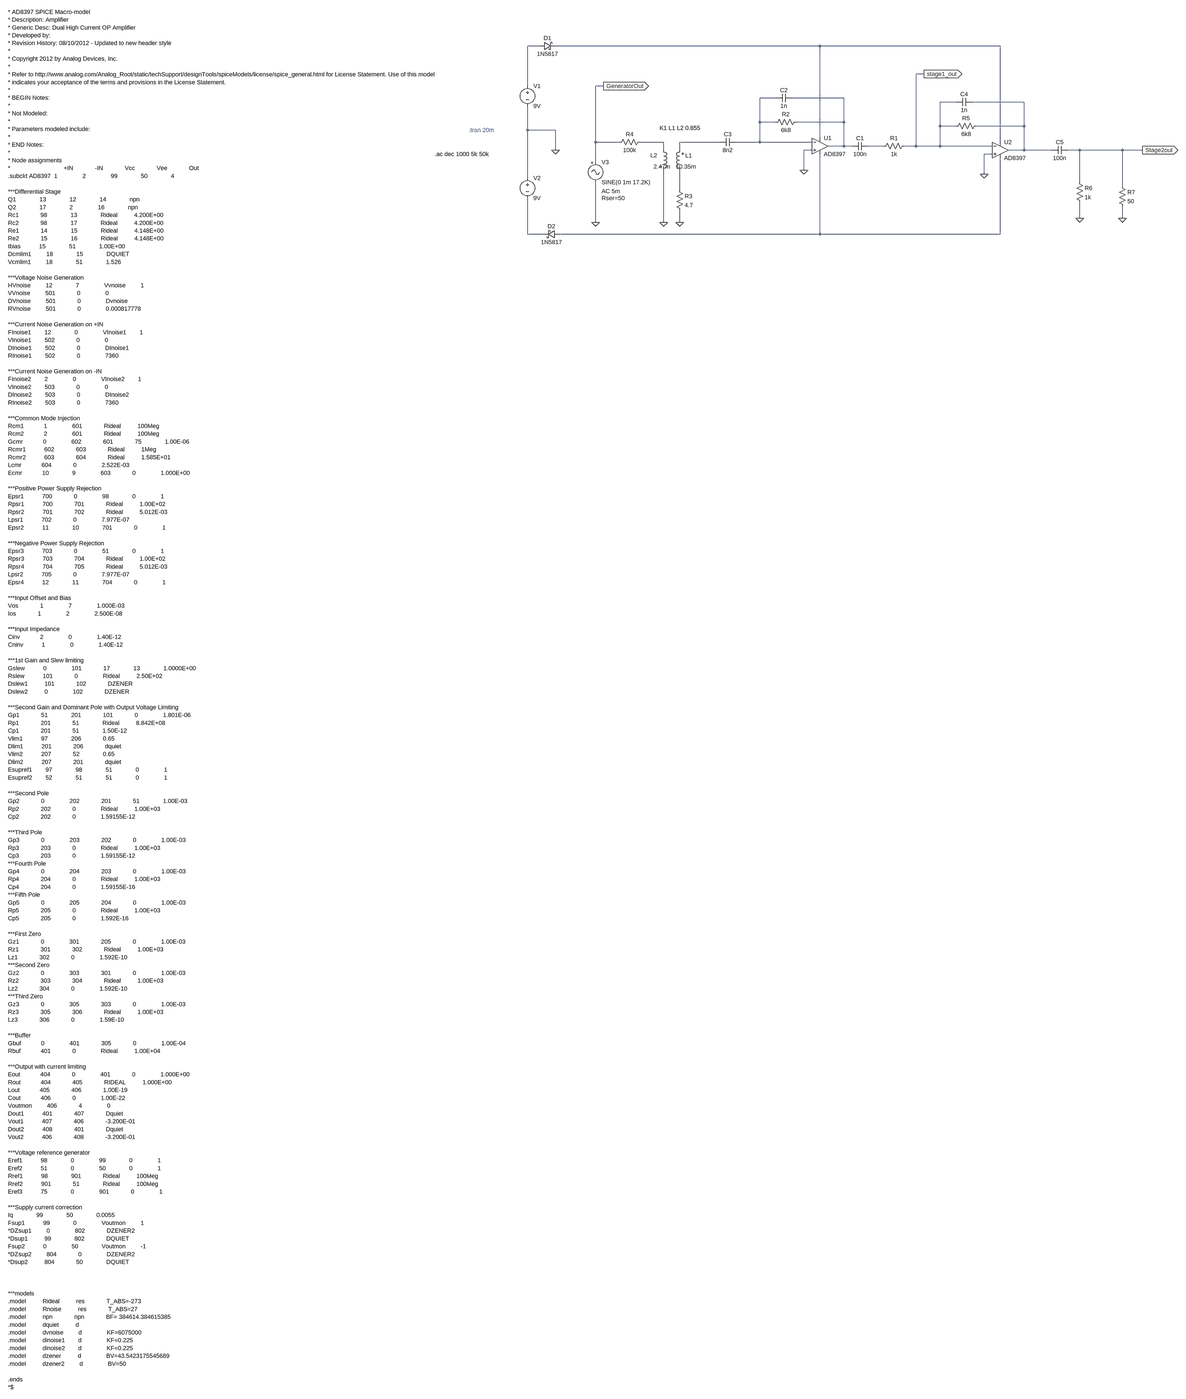
[diagram p0: schematic SAQ_Receiver_amplification_50ohm load.asc, whole sheet]
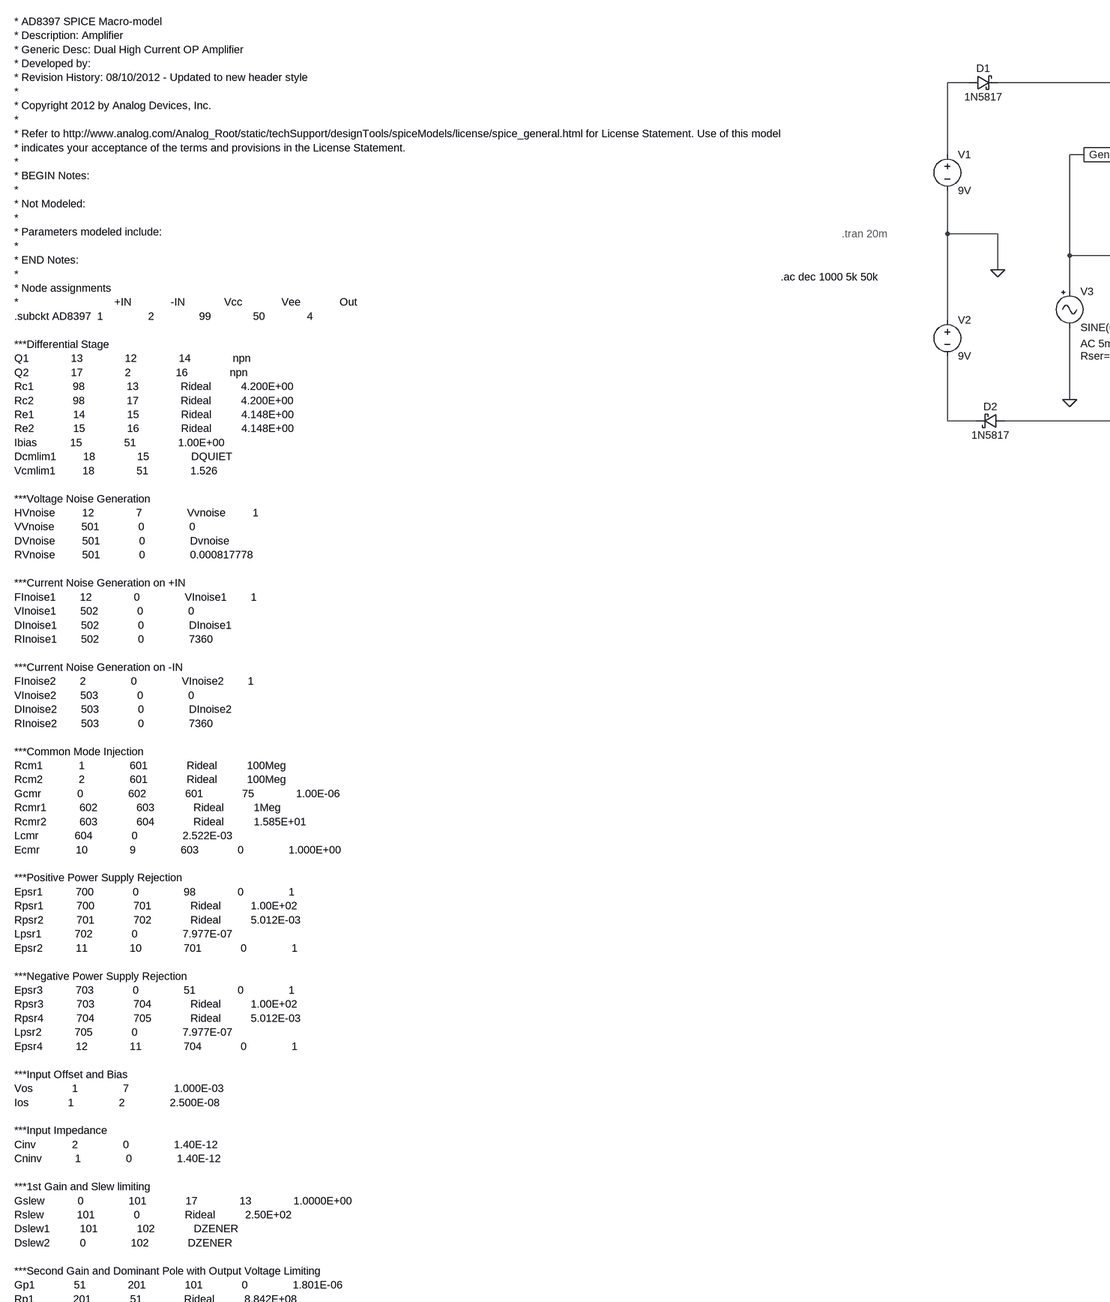
[diagram p1: schematic SAQ_Receiver_amplification_50ohm load.asc, part, row 1 of 2, column 1 of 2]
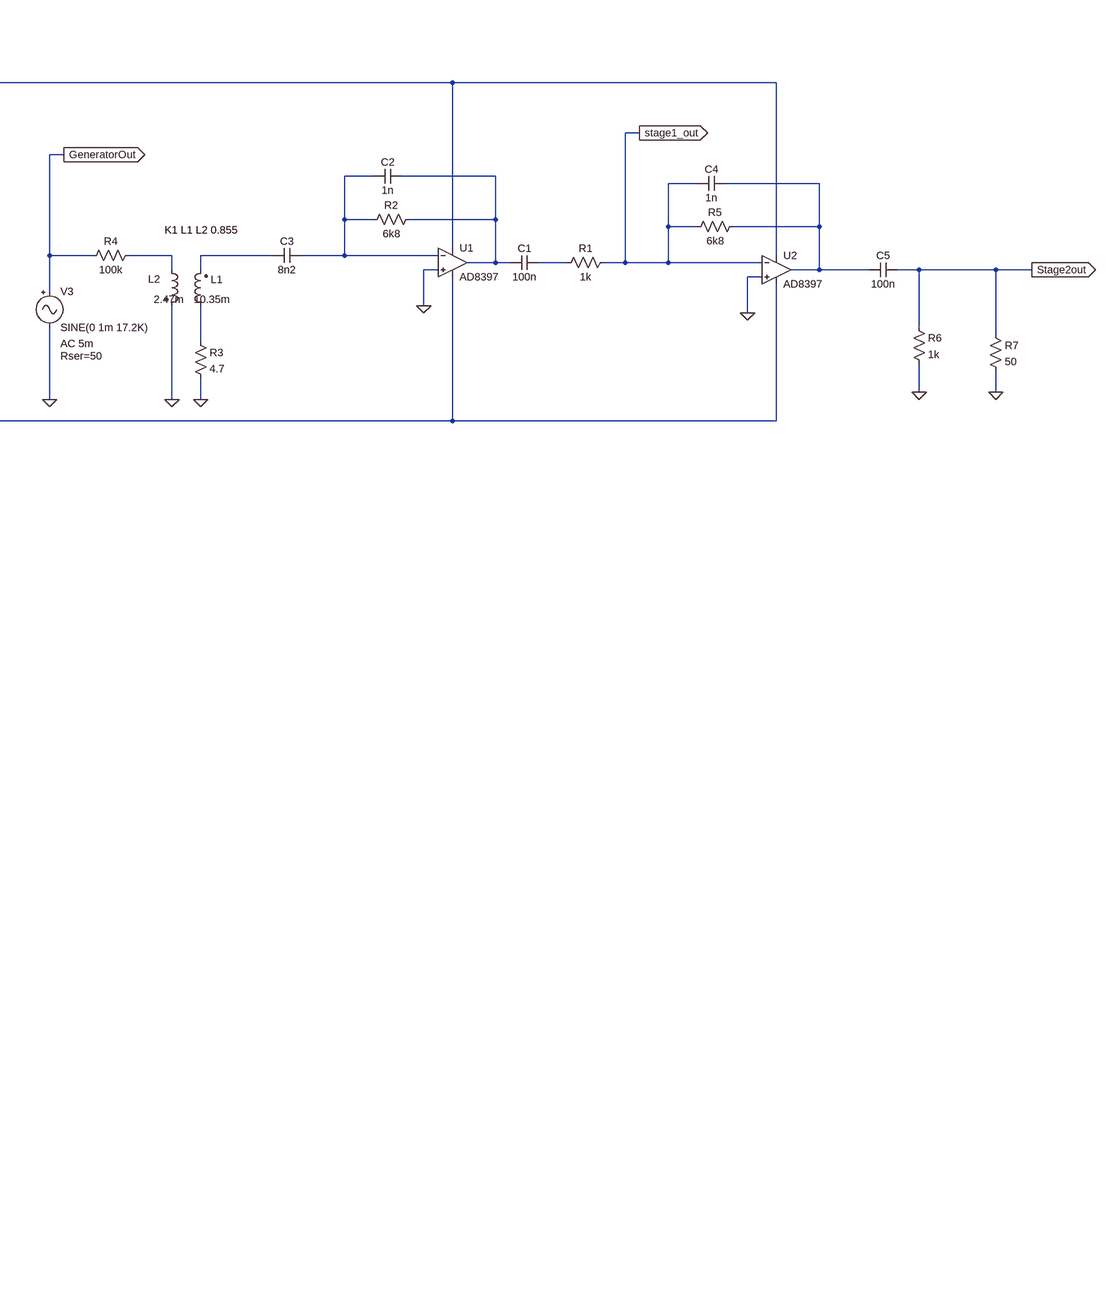
[diagram p2: schematic SAQ_Receiver_amplification_50ohm load.asc, part, row 1 of 2, column 2 of 2]
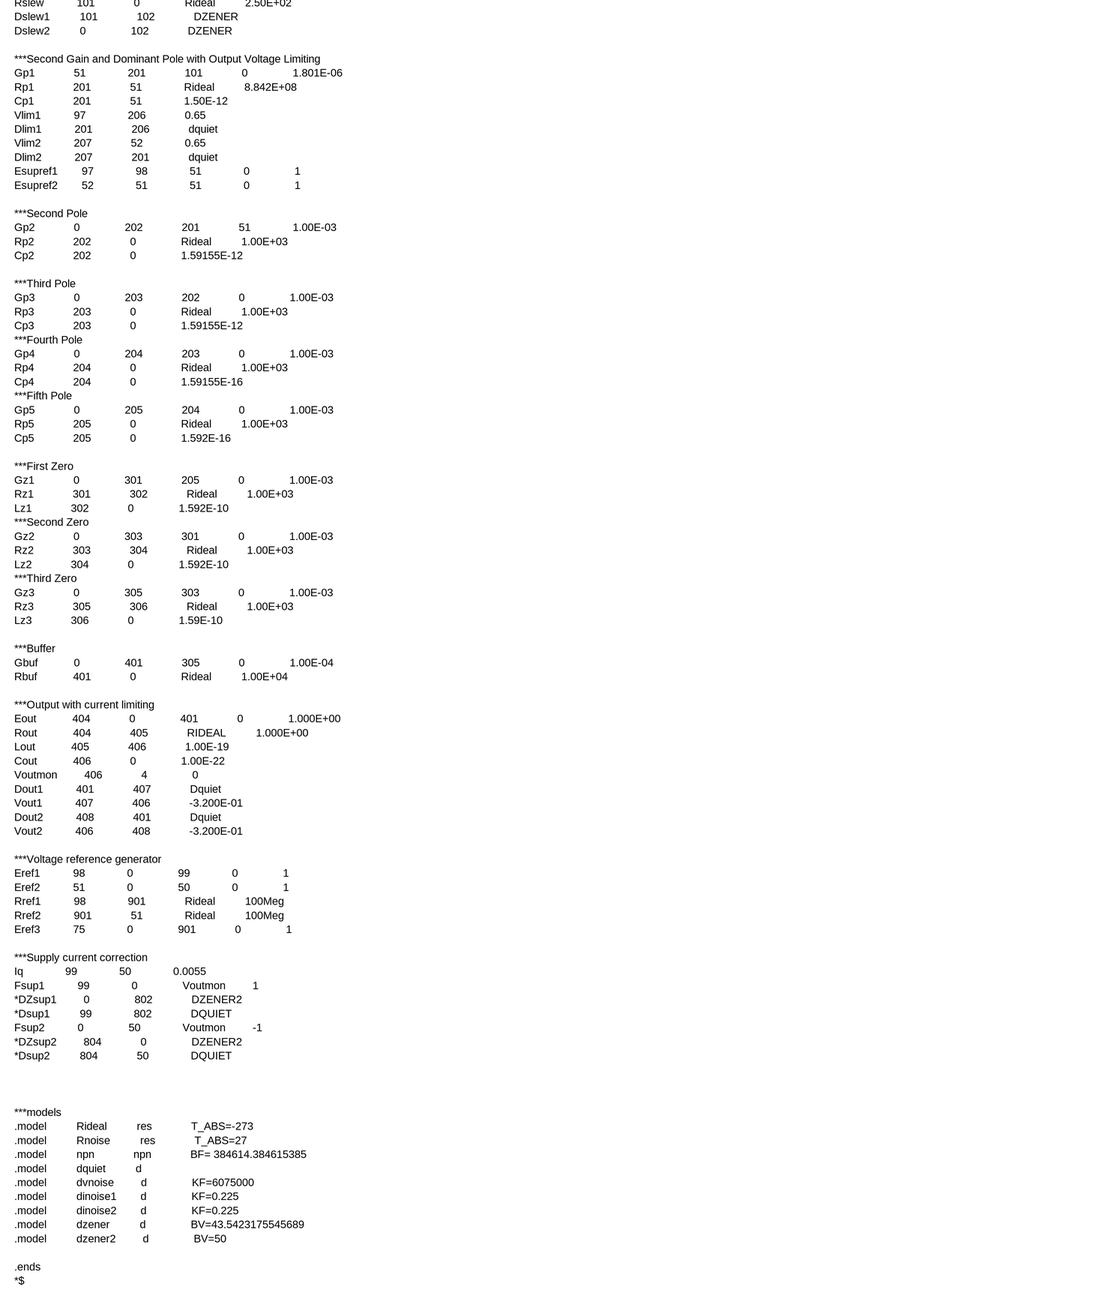
[diagram p3: schematic SAQ_Receiver_amplification_50ohm load.asc, part, row 2 of 2, column 1 of 2]
SAQ_Receiver_amplification_50ohm load.asc, the LTspice schematic file:
Version 4
SHEET 1 15028 7332
WIRE 12160 2272 12112 2272
WIRE 13440 2272 12224 2272
WIRE 14160 2272 13440 2272
WIRE 13856 2384 13824 2384
WIRE 12112 2432 12112 2272
WIRE 12576 2432 12544 2432
WIRE 13264 2480 13200 2480
WIRE 13536 2480 13328 2480
WIRE 13984 2496 13920 2496
WIRE 14256 2496 14048 2496
WIRE 13200 2576 13200 2480
WIRE 13264 2576 13200 2576
WIRE 13536 2576 13536 2480
WIRE 13536 2576 13344 2576
WIRE 13920 2592 13920 2496
WIRE 13984 2592 13920 2592
WIRE 14256 2592 14256 2496
WIRE 14256 2592 14064 2592
WIRE 12112 2608 12112 2512
WIRE 12224 2608 12112 2608
WIRE 13440 2640 13440 2272
WIRE 12544 2656 12544 2432
WIRE 12640 2656 12544 2656
WIRE 12816 2656 12720 2656
WIRE 13040 2656 12880 2656
WIRE 13200 2656 13200 2576
WIRE 13200 2656 13104 2656
WIRE 13408 2656 13200 2656
WIRE 14160 2656 14160 2272
WIRE 13536 2672 13536 2576
WIRE 13536 2672 13472 2672
WIRE 13568 2672 13536 2672
WIRE 13696 2672 13632 2672
WIRE 13824 2672 13824 2384
WIRE 13824 2672 13776 2672
WIRE 13920 2672 13920 2592
WIRE 13920 2672 13824 2672
WIRE 14128 2672 13920 2672
WIRE 12224 2688 12224 2608
WIRE 12816 2688 12816 2656
WIRE 12880 2688 12880 2656
WIRE 13408 2688 13376 2688
WIRE 14256 2688 14256 2592
WIRE 14256 2688 14192 2688
WIRE 14464 2688 14256 2688
WIRE 14576 2688 14528 2688
WIRE 14768 2688 14576 2688
WIRE 14848 2688 14768 2688
WIRE 14128 2704 14096 2704
WIRE 12544 2736 12544 2656
WIRE 13376 2768 13376 2688
WIRE 14096 2784 14096 2704
WIRE 12112 2800 12112 2608
WIRE 14576 2816 14576 2688
WIRE 14768 2832 14768 2688
WIRE 12880 2848 12880 2768
WIRE 14576 2960 14576 2896
WIRE 14768 2960 14768 2912
WIRE 12544 2976 12544 2816
WIRE 12816 2976 12816 2768
WIRE 12880 2976 12880 2928
WIRE 12112 3024 12112 2880
WIRE 12176 3024 12112 3024
WIRE 13440 3024 13440 2704
WIRE 13440 3024 12240 3024
WIRE 14160 3024 14160 2720
WIRE 14160 3024 13440 3024
FLAG 12224 2688 0
FLAG 13856 2384 stage1_out
IOPIN 13856 2384 Out
FLAG 13376 2768 0
FLAG 12880 2976 0
FLAG 12544 2976 0
FLAG 12816 2976 0
FLAG 14096 2784 0
FLAG 14848 2688 Stage2out
IOPIN 14848 2688 Out
FLAG 14576 2960 0
FLAG 14768 2960 0
FLAG 12576 2432 GeneratorOut
IOPIN 12576 2432 Out
DATAFLAG 13200 2656 ""
DATAFLAG 13440 2272 ""
DATAFLAG 13440 3024 ""
SYMBOL OpAmps\\opamp2 13440 2608 R0
SYMATTR InstName U1
SYMATTR Value AD8397
SYMBOL voltage 12112 2416 R0
SYMATTR InstName V1
SYMATTR Value 9V
SYMBOL voltage 12112 2784 R0
SYMATTR InstName V2
SYMATTR Value 9V
SYMBOL res 13792 2656 R90
WINDOW 0 0 56 VBottom 2
WINDOW 3 32 56 VTop 2
SYMATTR InstName R1
SYMATTR Value 1k
SYMBOL cap 13328 2464 R90
WINDOW 0 0 32 VBottom 2
WINDOW 3 32 32 VTop 2
SYMATTR InstName C2
SYMATTR Value 1n
SYMBOL res 13360 2560 R90
WINDOW 0 0 56 VBottom 2
WINDOW 3 32 56 VTop 2
SYMATTR InstName R2
SYMATTR Value 6k8
SYMBOL cap 13104 2640 R90
WINDOW 0 0 32 VBottom 2
WINDOW 3 32 32 VTop 2
SYMATTR InstName C3
SYMATTR Value 8n2
SYMBOL ind2 12896 2784 R180
WINDOW 0 -33 74 Left 2
WINDOW 3 -50 30 Left 2
SYMATTR InstName L1
SYMATTR Value 10.35m
SYMATTR Type ind
SYMBOL res 12864 2832 R0
SYMATTR InstName R3
SYMATTR Value 4.7
SYMBOL cap 13632 2656 R90
WINDOW 0 0 32 VBottom 2
WINDOW 3 32 32 VTop 2
SYMATTR InstName C1
SYMATTR Value 100n
SYMBOL Misc\\signal 12544 2720 R0
WINDOW 123 24 132 Left 2
WINDOW 39 24 160 Left 2
SYMATTR Value2 AC 5m
SYMATTR SpiceLine Rser=50
SYMATTR InstName V3
SYMATTR Value SINE(0 1m 17.2K)
SYMBOL ind2 12800 2672 R0
WINDOW 0 -37 37 Left 2
WINDOW 3 -24 82 Left 2
SYMATTR InstName L2
SYMATTR Value 2.47m
SYMATTR Type ind
SYMBOL res 12736 2640 R90
WINDOW 0 0 56 VBottom 2
WINDOW 3 32 56 VTop 2
SYMATTR InstName R4
SYMATTR Value 100k
SYMBOL OpAmps\\opamp2 14160 2624 R0
SYMATTR InstName U2
SYMATTR Value AD8397
SYMBOL cap 14048 2480 R90
WINDOW 0 0 32 VBottom 2
WINDOW 3 32 32 VTop 2
SYMATTR InstName C4
SYMATTR Value 1n
SYMBOL res 14080 2576 R90
WINDOW 0 0 56 VBottom 2
WINDOW 3 32 56 VTop 2
SYMATTR InstName R5
SYMATTR Value 6k8
SYMBOL cap 14528 2672 R90
WINDOW 0 0 32 VBottom 2
WINDOW 3 32 32 VTop 2
SYMATTR InstName C5
SYMATTR Value 100n
SYMBOL res 14560 2800 R0
SYMATTR InstName R6
SYMATTR Value 1k
SYMBOL schottky 12160 2288 R270
WINDOW 0 32 32 VTop 2
WINDOW 3 0 32 VBottom 2
SYMATTR InstName D1
SYMATTR Value 1N5817
SYMATTR Description Diode
SYMATTR Type diode
SYMBOL schottky 12240 3008 R90
WINDOW 0 0 32 VBottom 2
WINDOW 3 32 32 VTop 2
SYMATTR InstName D2
SYMATTR Value 1N5817
SYMATTR Description Diode
SYMATTR Type diode
SYMBOL res 14752 2816 R0
SYMATTR InstName R7
SYMATTR Value 50
TEXT 10024 2136 Left 2 !* AD8397 SPICE Macro-model        \n* Description: Amplifier\n* Generic Desc: Dual High Current OP Amplifier\n* Developed by:\n* Revision History: 08/10/2012 - Updated to new header style\n* \n* Copyright 2012 by Analog Devices, Inc.\n*\n* Refer to http://www.analog.com/Analog_Root/static/techSupport/designTools/spiceModels/license/spice_general.html for License Statement. Use of this model \n* indicates your acceptance of the terms and provisions in the License Statement.\n* \n* BEGIN Notes:\n*\n* Not Modeled:\n*    \n* Parameters modeled include: \n*\n* END Notes:\n*\n* Node assignments\n*                                +IN             -IN             Vcc             Vee             Out                             \n.subckt AD8397  1               2               99              50              4                               \n                                                                                                                \n***Differential Stage                                                                                                           \nQ1              13              12              14              npn                                             \nQ2              17              2               16              npn                                             \nRc1             98              13              Rideal          4.200E+00                                       \nRc2             98              17              Rideal          4.200E+00                                       \nRe1             14              15              Rideal          4.148E+00                                       \nRe2             15              16              Rideal          4.148E+00                                       \nIbias           15              51              1.00E+00                                                        \nDcmlim1         18              15              DQUIET                                                          \nVcmlim1         18              51              1.526                                                           \n                                                                                                                \n***Voltage Noise Generation                                                                                                     \nHVnoise         12              7               Vvnoise         1                                               \nVVnoise         501             0               0                                                               \nDVnoise         501             0               Dvnoise                                                         \nRVnoise         501             0               0.000817778                                                     \n                                                                                                                \n***Current Noise Generation on +IN                                                                                                              \nFInoise1        12              0               VInoise1        1                                               \nVInoise1        502             0               0                                                               \nDInoise1        502             0               DInoise1                                                        \nRInoise1        502             0               7360                                                            \n                                                                                                                \n***Current Noise Generation on -IN                                                                                                              \nFInoise2        2               0               VInoise2        1                                               \nVInoise2        503             0               0                                                               \nDInoise2        503             0               DInoise2                                                        \nRInoise2        503             0               7360                                                            \n \n***Common Mode Injection                                                                                        \nRcm1            1               601             Rideal          100Meg                          \nRcm2            2               601             Rideal          100Meg                          \nGcmr            0               602             601             75              1.00E-06        \nRcmr1           602             603             Rideal          1Meg                            \nRcmr2           603             604             Rideal          1.585E+01                       \nLcmr            604             0               2.522E-03                                       \nEcmr            10              9               603             0               1.000E+00       \n \n***Positive Power Supply Rejection                                                                                              \nEpsr1           700             0               98              0               1               \nRpsr1           700             701             Rideal          1.00E+02                        \nRpsr2           701             702             Rideal          5.012E-03                       \nLpsr1           702             0               7.977E-07                                       \nEpsr2           11              10              701             0               1               \n \n***Negative Power Supply Rejection                                                                              \nEpsr3           703             0               51              0               1\nRpsr3           703             704             Rideal          1.00E+02        \nRpsr4           704             705             Rideal          5.012E-03       \nLpsr2           705             0               7.977E-07                       \nEpsr4           12              11              704             0               1\n \n***Input Offset and Bias                                                                        \nVos             1               7               1.000E-03                       \nIos             1               2               2.500E-08                       \n \n***Input Impedance                                                                              \nCinv            2               0               1.40E-12                        \nCninv           1               0               1.40E-12                        \n \n***1st Gain and Slew limiting                                                                   \nGslew           0               101             17              13              1.0000E+00      \nRslew           101             0               Rideal          2.50E+02                        \nDslew1          101             102             DZENER                                          \nDslew2          0               102             DZENER                                          \n \n***Second Gain and Dominant Pole with Output Voltage Limiting                                                                                   \nGp1             51              201             101             0               1.801E-06       \nRp1             201             51              Rideal          8.842E+08                       \nCp1             201             51              1.50E-12                                        \nVlim1           97              206             0.65                                            \nDlim1           201             206             dquiet                                          \nVlim2           207             52              0.65                                            \nDlim2           207             201             dquiet                                          \nEsupref1        97              98              51              0               1               \nEsupref2        52              51              51              0               1               \n                                                                                                \n***Second Pole                                                                                  \nGp2             0               202             201             51              1.00E-03        \nRp2             202             0               Rideal          1.00E+03                        \nCp2             202             0               1.59155E-12                                     \n                                                                                                \n***Third Pole                                                                                   \nGp3             0               203             202             0               1.00E-03        \nRp3             203             0               Rideal          1.00E+03                        \nCp3             203             0               1.59155E-12                                     \n***Fourth Pole                                                                                  \nGp4             0               204             203             0               1.00E-03        \nRp4             204             0               Rideal          1.00E+03                        \nCp4             204             0               1.59155E-16                                     \n***Fifth Pole                                                                                   \nGp5             0               205             204             0               1.00E-03        \nRp5             205             0               Rideal          1.00E+03                        \nCp5             205             0               1.592E-16                                       \n                                                                                                \n***First Zero                                                                                   \nGz1             0               301             205             0               1.00E-03        \nRz1             301             302             Rideal          1.00E+03                        \nLz1             302             0               1.592E-10                                       \n***Second Zero                                                                                  \nGz2             0               303             301             0               1.00E-03        \nRz2             303             304             Rideal          1.00E+03                        \nLz2             304             0               1.592E-10                                       \n***Third Zero                                                                                   \nGz3             0               305             303             0               1.00E-03        \nRz3             305             306             Rideal          1.00E+03                        \nLz3             306             0               1.59E-10                                        \n                                                                                                \n***Buffer                                                                                       \nGbuf            0               401             305             0               1.00E-04                                                        \nRbuf            401             0               Rideal          1.00E+04                                                                        \n                                                                                                                                                \n***Output with current limiting                                                                                                                                 \nEout            404             0               401             0               1.000E+00                                                       \nRout            404             405             RIDEAL          1.000E+00                                                                       \nLout            405             406             1.00E-19                                                                                        \nCout            406             0               1.00E-22                                                                                        \nVoutmon         406             4               0                                                                                               \nDout1           401             407             Dquiet                                                                                          \nVout1           407             406             -3.200E-01                                                                                      \nDout2           408             401             Dquiet                                                                                          \nVout2           406             408             -3.200E-01                                                                                      \n \n***Voltage reference generator                                                                                                                                  \nEref1           98              0               99              0               1                                                               \nEref2           51              0               50              0               1                               \nRref1           98              901             Rideal          100Meg                                          \nRref2           901             51              Rideal          100Meg                                          \nEref3           75              0               901             0               1                               \n \n***Supply current correction                                                                                                    \nIq              99              50              0.0055                                                          \nFsup1           99              0               Voutmon         1                                               \n*DZsup1         0               802             DZENER2                                                         \n*Dsup1          99              802             DQUIET                                                          \nFsup2           0               50              Voutmon         -1                                              \n*DZsup2         804             0               DZENER2                                                         \n*Dsup2          804             50              DQUIET                                                          \n \n                                                                                                                \n                                                                                                                \n                                                                                                                \n                                                                                                                \n                                                                                                                \n                                                                                                                \n                                                                                                                \n                                                                                                                \n                                                                                                                \n                                                                                                                \n \n***models                                                                                                       \n.model          Rideal          res             T_ABS=-273                                                      \n.model          Rnoise          res             T_ABS=27                                                        \n.model          npn             npn             BF= 384614.384615385                                                            \n.model          dquiet          d                                                                               \n.model          dvnoise         d               KF=6075000                                                      \n.model          dinoise1        d               KF=0.225                                                        \n.model          dinoise2        d               KF=0.225\n.model          dzener          d               BV=43.5423175545689\n.model          dzener2         d               BV=50\n                                                \n.ends                                           \n*$
TEXT 11864 2608 Left 2 ;.tran 20m
TEXT 12800 2600 Left 2 !K1 L1 L2 0.855
TEXT 11728 2704 Left 2 !.ac dec 1000 5k 50k

The netlist it stands for:
* SAQ_Receiver_amplification_50ohm load.asc
XU1 0 N003 N002 N011 N004 AD8397  ; pins In+ In- V+ V- OUT
V1 N001 0 9V
V2 0 N010 9V
R1 stage1_out N008 1k
C2 N004 N003 1n
R2 N004 N003 6k8
C3 N003 N007 8n2
L1 N009 N007 10.35m
R3 N009 0 4.7
C1 N008 N004 100n
V3 GeneratorOut 0 SINE(0 1m 17.2K) AC 5m Rser=50
L2 N006 0 2.47m
R4 N006 GeneratorOut 100k
XU2 0 stage1_out N002 N011 N005 AD8397  ; pins In+ In- V+ V- OUT
C4 N005 stage1_out 1n
R5 N005 stage1_out 6k8
C5 Stage2out N005 100n
R6 Stage2out 0 1k
D1 N001 N002 1N5817
D2 N011 N010 1N5817
R7 Stage2out 0 50
.model D D
.lib standard.dio
* AD8397 SPICE Macro-model
* Description: Amplifier
* Generic Desc: Dual High Current OP Amplifier
* Developed by:
* Revision History: 08/10/2012 - Updated to new header style
*
* Copyright 2012 by Analog Devices, Inc.
*
* Refer to http://www.analog.com/Analog_Root/static/techSupport/designTools/spiceModels/license/spice_general.html for License Statement. Use of this model
* indicates your acceptance of the terms and provisions in the License Statement.
*
* BEGIN Notes:
*
* Not Modeled:
*
* Parameters modeled include:
*
* END Notes:
*
* Node assignments
*                                +IN             -IN             Vcc             Vee             Out
.subckt AD8397  1               2               99              50              4
***Differential Stage
Q1              13              12              14              npn
Q2              17              2               16              npn
Rc1             98              13              Rideal          4.200E+00
Rc2             98              17              Rideal          4.200E+00
Re1             14              15              Rideal          4.148E+00
Re2             15              16              Rideal          4.148E+00
Ibias           15              51              1.00E+00
Dcmlim1         18              15              DQUIET
Vcmlim1         18              51              1.526
***Voltage Noise Generation
HVnoise         12              7               Vvnoise         1
VVnoise         501             0               0
DVnoise         501             0               Dvnoise
RVnoise         501             0               0.000817778
***Current Noise Generation on +IN
FInoise1        12              0               VInoise1        1
VInoise1        502             0               0
DInoise1        502             0               DInoise1
RInoise1        502             0               7360
***Current Noise Generation on -IN
FInoise2        2               0               VInoise2        1
VInoise2        503             0               0
DInoise2        503             0               DInoise2
RInoise2        503             0               7360
***Common Mode Injection
Rcm1            1               601             Rideal          100Meg
Rcm2            2               601             Rideal          100Meg
Gcmr            0               602             601             75              1.00E-06
Rcmr1           602             603             Rideal          1Meg
Rcmr2           603             604             Rideal          1.585E+01
Lcmr            604             0               2.522E-03
Ecmr            10              9               603             0               1.000E+00
***Positive Power Supply Rejection
Epsr1           700             0               98              0               1
Rpsr1           700             701             Rideal          1.00E+02
Rpsr2           701             702             Rideal          5.012E-03
Lpsr1           702             0               7.977E-07
Epsr2           11              10              701             0               1
***Negative Power Supply Rejection
Epsr3           703             0               51              0               1
Rpsr3           703             704             Rideal          1.00E+02
Rpsr4           704             705             Rideal          5.012E-03
Lpsr2           705             0               7.977E-07
Epsr4           12              11              704             0               1
***Input Offset and Bias
Vos             1               7               1.000E-03
Ios             1               2               2.500E-08
***Input Impedance
Cinv            2               0               1.40E-12
Cninv           1               0               1.40E-12
***1st Gain and Slew limiting
Gslew           0               101             17              13              1.0000E+00
Rslew           101             0               Rideal          2.50E+02
Dslew1          101             102             DZENER
Dslew2          0               102             DZENER
***Second Gain and Dominant Pole with Output Voltage Limiting
Gp1             51              201             101             0               1.801E-06
Rp1             201             51              Rideal          8.842E+08
Cp1             201             51              1.50E-12
Vlim1           97              206             0.65
Dlim1           201             206             dquiet
Vlim2           207             52              0.65
Dlim2           207             201             dquiet
Esupref1        97              98              51              0               1
Esupref2        52              51              51              0               1
***Second Pole
Gp2             0               202             201             51              1.00E-03
Rp2             202             0               Rideal          1.00E+03
Cp2             202             0               1.59155E-12
***Third Pole
Gp3             0               203             202             0               1.00E-03
Rp3             203             0               Rideal          1.00E+03
Cp3             203             0               1.59155E-12
***Fourth Pole
Gp4             0               204             203             0               1.00E-03
Rp4             204             0               Rideal          1.00E+03
Cp4             204             0               1.59155E-16
***Fifth Pole
Gp5             0               205             204             0               1.00E-03
Rp5             205             0               Rideal          1.00E+03
Cp5             205             0               1.592E-16
***First Zero
Gz1             0               301             205             0               1.00E-03
Rz1             301             302             Rideal          1.00E+03
Lz1             302             0               1.592E-10
***Second Zero
Gz2             0               303             301             0               1.00E-03
Rz2             303             304             Rideal          1.00E+03
Lz2             304             0               1.592E-10
***Third Zero
Gz3             0               305             303             0               1.00E-03
Rz3             305             306             Rideal          1.00E+03
Lz3             306             0               1.59E-10
***Buffer
Gbuf            0               401             305             0               1.00E-04
Rbuf            401             0               Rideal          1.00E+04
***Output with current limiting
Eout            404             0               401             0               1.000E+00
Rout            404             405             RIDEAL          1.000E+00
Lout            405             406             1.00E-19
Cout            406             0               1.00E-22
Voutmon         406             4               0
Dout1           401             407             Dquiet
Vout1           407             406             -3.200E-01
Dout2           408             401             Dquiet
Vout2           406             408             -3.200E-01
***Voltage reference generator
Eref1           98              0               99              0               1
Eref2           51              0               50              0               1
Rref1           98              901             Rideal          100Meg
Rref2           901             51              Rideal          100Meg
Eref3           75              0               901             0               1
***Supply current correction
Iq              99              50              0.0055
Fsup1           99              0               Voutmon         1
*DZsup1         0               802             DZENER2
*Dsup1          99              802             DQUIET
Fsup2           0               50              Voutmon         -1
*DZsup2         804             0               DZENER2
*Dsup2          804             50              DQUIET
***models
.model          Rideal          res             T_ABS=-273
.model          Rnoise          res             T_ABS=27
.model          npn             npn             BF= 384614.384615385
.model          dquiet          d
.model          dvnoise         d               KF=6075000
.model          dinoise1        d               KF=0.225
.model          dinoise2        d               KF=0.225
.model          dzener          d               BV=43.5423175545689
.model          dzener2         d               BV=50
.ends
*$
* .tran 20m
K1 L1 L2 0.855
.ac dec 1000 5k 50k
.backanno
.end